# Altium project Graviton.PrjPcb (part 1 of 3)
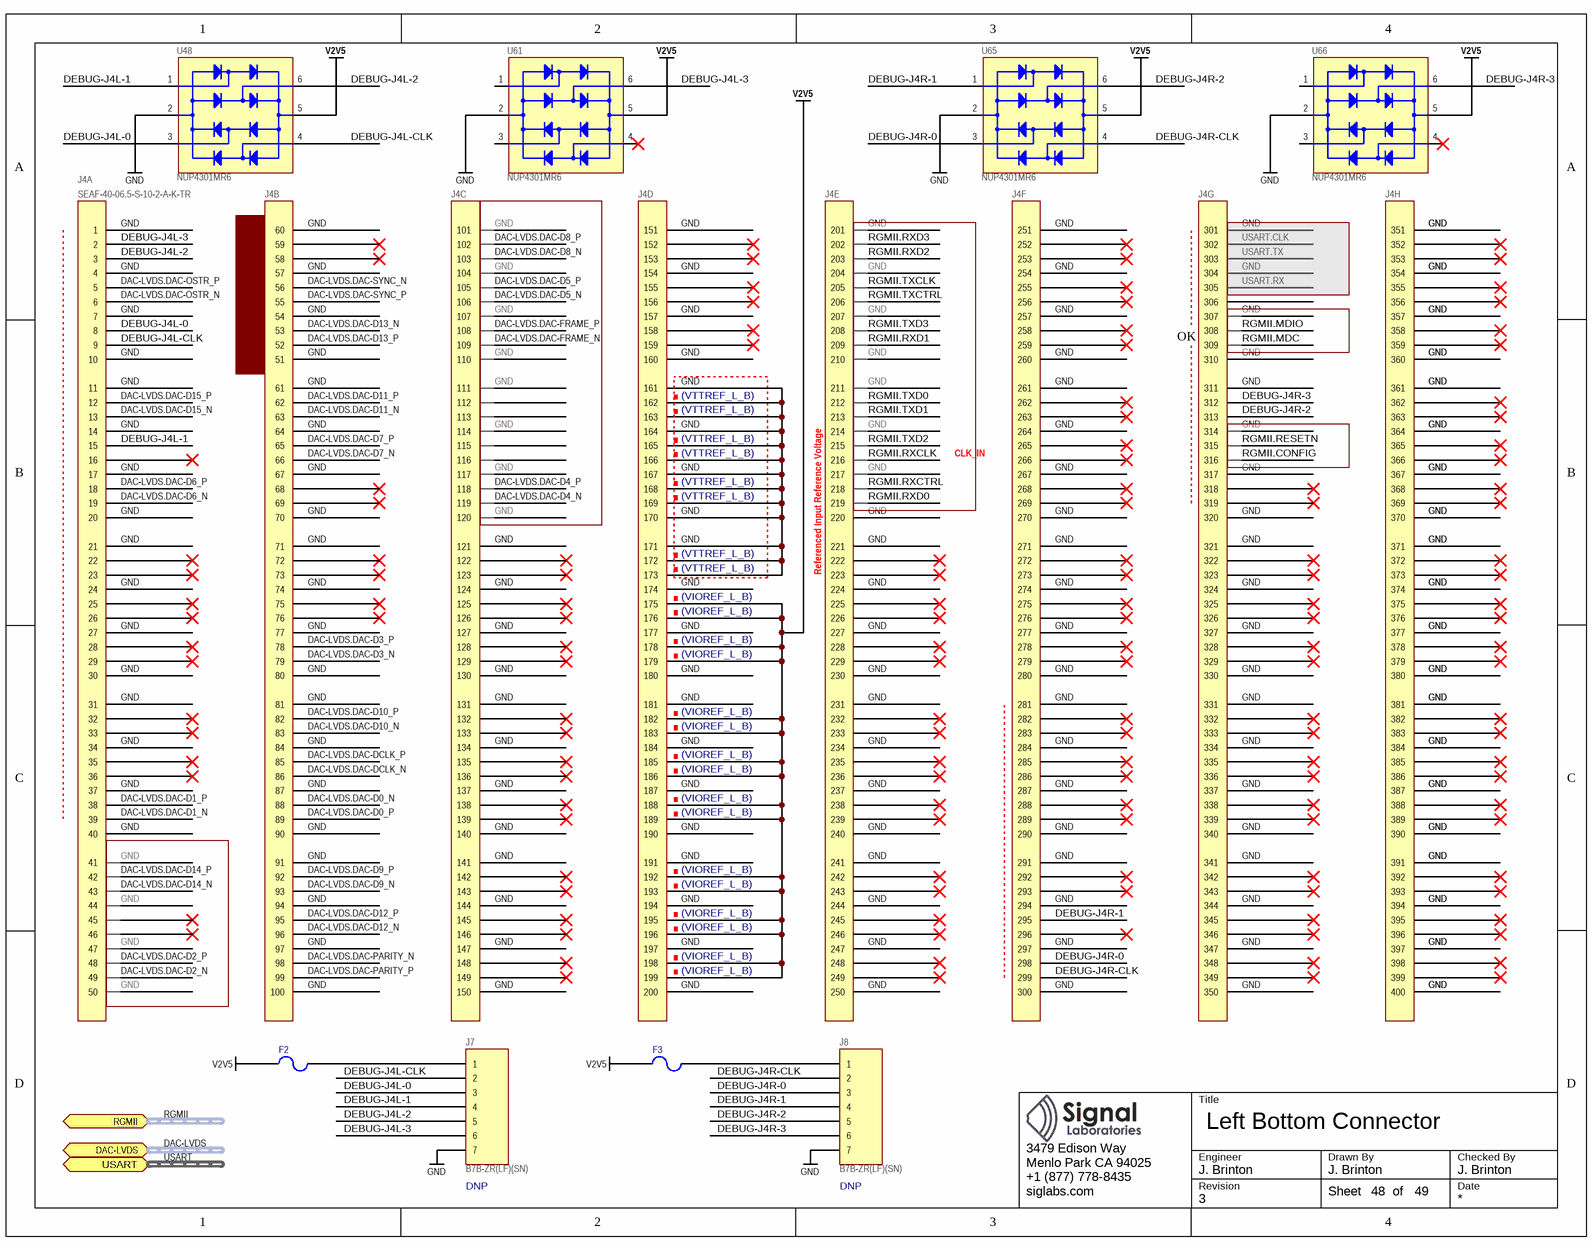
[diagram p0: con-left-bot.SchDoc]
23 sheets, 484 parts. Net scope: hierarchical (ports join the sheet entries above them; power ports are global).
Board file: graviton.PcbDoc
Sheets:
  con-left-bot.SchDoc
  con-right-bot.SchDoc
  eth.SchDoc
    ETH-LDO = eth-ldo.SchDoc
  dsa.SchDoc
  ifamp-tx.SchDoc
  amp-33dbm.SchDoc
  ifamp-rx.SchDoc
  dac.SchDoc
    DAC-DIGITAL = dac-digital.SchDoc
    DAC-ANALOG = dac-analog.SchDoc
    DAC-POWER = dac-power.SchDoc
    DAC-MISC = dac-misc.SchDoc
    DAC-LDO = dac-ldo.SchDoc
  adc.SchDoc
    ADC-DIGITAL = adc-digital.SchDoc
    ADC-POWER = adc-power.SchDoc
    ADC-ANALOG = adc-analog.SchDoc
    ADC-LDO = adc-ldo.SchDoc
  fans.SchDoc
  clock.SchDoc
  ingress.SchDoc
  adc-amp.SchDoc

## Sheet con-left-bot.SchDoc: Left Bottom Connector
size Letter; CheckedBy: J. Brinton; CompanyName: Signal Laboratories, Inc.; DrawnBy: J. Brinton; Engineer: J. Brinton; Address1: 3479 Edison Way; Address2: Menlo Park CA 94025; Address3: +1 (877) 778-8435; Address4: siglabs.com; Revision: 3; SheetNumber: 48; SheetTotal: 49; ModifiedDate: 4/20/2018

### Parts
F2  0ZCJ0020FF2E  [1206]  (value not drawn)
F3  0ZCJ0020FF2E  [1206]  (value not drawn)
J4  SEAF-40-06.5-S-10-2-A-K-TR  [SEAF-40-06.5-S-10-2-A-K-TR]  (parts A,B,C,D,E,F,G,H of 8)
J7  B7B-ZR(LF)(SN)  Do Not Place: DNP  [B7B-ZR]
J8  B7B-ZR(LF)(SN)  Do Not Place: DNP  [B7B-ZR]
U48  NUP4301MR6  [SOT23-6]
U61  NUP4301MR6  [SOT23-6]
U65  NUP4301MR6  [SOT23-6]
U66  NUP4301MR6  [SOT23-6]

### Ports
DAC-LVDS (harness DAC-LVDS), RGMII (harness RGMII), USART (harness USART-2V5)

### Nets
GND: J4.1 J4.4 J4.7 J4.10 J4.11 J4.14 J4.17 J4.20 J4.21 J4.24 J4.27 J4.30 J4.31 J4.34 J4.37 J4.40 J4.41 J4.44 J4.47 J4.50 J4.51 J4.54 J4.57 J4.60 J4.61 J4.64 J4.67 J4.70 J4.71 J4.74 J4.77 J4.80 J4.81 J4.84 J4.87 J4.90 J4.91 J4.94 J4.97 J4.100 J4.101 J4.104 J4.107 J4.110 J4.111 J4.114 J4.117 J4.120 J4.121 J4.124 J4.127 J4.130 J4.131 J4.134 J4.137 J4.140 J4.141 J4.144 J4.147 J4.150 J4.151 J4.154 J4.157 J4.160 J4.161 J4.162 J4.163 J4.164 J4.165 J4.166 J4.167 J4.168 J4.169 J4.170 J4.171 J4.172 J4.173 J4.174 J4.177 J4.180 J4.181 J4.184 J4.187 J4.190 J4.191 J4.194 J4.197 J4.200 J4.201 J4.204 J4.207 J4.210 J4.211 J4.214 J4.217 J4.220 J4.221 J4.224 J4.227 J4.230 J4.231 J4.234 J4.237 J4.240 J4.241 J4.244 J4.247 J4.250 J4.251 J4.254 J4.257 J4.260 J4.261 J4.264 J4.267 J4.270 J4.271 J4.274 J4.277 J4.280 J4.281 J4.284 J4.287 J4.290 J4.291 J4.294 J4.297 J4.300 J4.301 J4.304 J4.307 J4.310 J4.311 J4.314 J4.317 J4.320 J4.321 J4.324 J4.327 J4.330 J4.331 J4.334 J4.337 J4.340 J4.341 J4.344 J4.347 J4.350 J4.351 J4.354 J4.357 J4.360 J4.361 J4.364 J4.367 J4.370 J4.371 J4.374 J4.377 J4.380 J4.381 J4.384 J4.387 J4.390 J4.391 J4.394 J4.397 J4.400 J7.7 J8.7 U48.2(VN) U61.2(VN) U65.2(VN) U66.2(VN)
V2V5: F2.2 F3.2 J4.175 J4.176 J4.178 J4.179 J4.182 J4.183 J4.185 J4.186 J4.188 J4.189 J4.192 J4.193 J4.195 J4.196 J4.198 J4.199 U48.5(VP) U61.5(VP) U65.5(VP) U66.5(VP)
DAC-LVDS.DAC-D0_N: J4.88  [project net DAC-LVDS.DAC-D0_N_48]
DAC-LVDS.DAC-D0_P: J4.89  [project net DAC-LVDS.DAC-D0_P_48]
DAC-LVDS.DAC-D1_N: J4.39  [project net DAC-LVDS.DAC-D1_N_48]
DAC-LVDS.DAC-D1_P: J4.38  [project net DAC-LVDS.DAC-D1_P_48]
DAC-LVDS.DAC-D2_N: J4.49  [project net DAC-LVDS.DAC-D2_N_48]
DAC-LVDS.DAC-D2_P: J4.48  [project net DAC-LVDS.DAC-D2_P_48]
DAC-LVDS.DAC-D3_N: J4.79  [project net DAC-LVDS.DAC-D3_N_48]
DAC-LVDS.DAC-D3_P: J4.78  [project net DAC-LVDS.DAC-D3_P_48]
DAC-LVDS.DAC-D4_N: J4.119  [project net DAC-LVDS.DAC-D4_N_48]
DAC-LVDS.DAC-D4_P: J4.118  [project net DAC-LVDS.DAC-D4_P_48]
DAC-LVDS.DAC-D5_N: J4.106  [project net DAC-LVDS.DAC-D5_N_48]
DAC-LVDS.DAC-D5_P: J4.105  [project net DAC-LVDS.DAC-D5_P_48]
DAC-LVDS.DAC-D6_N: J4.19  [project net DAC-LVDS.DAC-D6_N_48]
DAC-LVDS.DAC-D6_P: J4.18  [project net DAC-LVDS.DAC-D6_P_48]
DAC-LVDS.DAC-D7_N: J4.66  [project net DAC-LVDS.DAC-D7_N_48]
DAC-LVDS.DAC-D7_P: J4.65  [project net DAC-LVDS.DAC-D7_P_48]
DAC-LVDS.DAC-D8_N: J4.103  [project net DAC-LVDS.DAC-D8_N_48]
DAC-LVDS.DAC-D8_P: J4.102  [project net DAC-LVDS.DAC-D8_P_48]
DAC-LVDS.DAC-D9_N: J4.93  [project net DAC-LVDS.DAC-D9_N_48]
DAC-LVDS.DAC-D9_P: J4.92  [project net DAC-LVDS.DAC-D9_P_48]
DAC-LVDS.DAC-D10_N: J4.83  [project net DAC-LVDS.DAC-D10_N_48]
DAC-LVDS.DAC-D10_P: J4.82  [project net DAC-LVDS.DAC-D10_P_48]
DAC-LVDS.DAC-D11_N: J4.63  [project net DAC-LVDS.DAC-D11_N_48]
DAC-LVDS.DAC-D11_P: J4.62  [project net DAC-LVDS.DAC-D11_P_48]
DAC-LVDS.DAC-D12_N: J4.96  [project net DAC-LVDS.DAC-D12_N_48]
DAC-LVDS.DAC-D12_P: J4.95  [project net DAC-LVDS.DAC-D12_P_48]
DAC-LVDS.DAC-D13_N: J4.53  [project net DAC-LVDS.DAC-D13_N_48]
DAC-LVDS.DAC-D13_P: J4.52  [project net DAC-LVDS.DAC-D13_P_48]
DAC-LVDS.DAC-D14_N: J4.43  [project net DAC-LVDS.DAC-D14_N_48]
DAC-LVDS.DAC-D14_P: J4.42  [project net DAC-LVDS.DAC-D14_P_48]
DAC-LVDS.DAC-D15_N: J4.13  [project net DAC-LVDS.DAC-D15_N_48]
DAC-LVDS.DAC-D15_P: J4.12  [project net DAC-LVDS.DAC-D15_P_48]
DAC-LVDS.DAC-DCLK_N: J4.86  [project net DAC-LVDS.DAC-DCLK_N_48]
DAC-LVDS.DAC-DCLK_P: J4.85  [project net DAC-LVDS.DAC-DCLK_P_48]
DAC-LVDS.DAC-FRAME_N: J4.109  [project net DAC-LVDS.DAC-FRAME_N_48]
DAC-LVDS.DAC-FRAME_P: J4.108  [project net DAC-LVDS.DAC-FRAME_P_48]
DAC-LVDS.DAC-OSTR_N: J4.6  [project net DAC-LVDS.DAC-OSTR_N_48]
DAC-LVDS.DAC-OSTR_P: J4.5  [project net DAC-LVDS.DAC-OSTR_P_48]
DAC-LVDS.DAC-PARITY_N: J4.98  [project net DAC-LVDS.DAC-PARITY_N_48]
DAC-LVDS.DAC-PARITY_P: J4.99  [project net DAC-LVDS.DAC-PARITY_P_48]
DAC-LVDS.DAC-SYNC_N: J4.56  [project net DAC-LVDS.DAC-SYNC_N_48]
DAC-LVDS.DAC-SYNC_P: J4.55  [project net DAC-LVDS.DAC-SYNC_P_48]
DEBUG-J4L-0: J4.8 J7.3 U48.3(B)  [project net DEBUG-J4L-0_48]
DEBUG-J4L-1: J4.15 J7.4 U48.1(A)  [project net DEBUG-J4L-1_48]
DEBUG-J4L-2: J4.3 J7.5 U48.6(D)  [project net DEBUG-J4L-2_48]
DEBUG-J4L-3: J4.2 J7.6 U61.6(D)  [project net DEBUG-J4L-3_48]
DEBUG-J4L-CLK: J4.9 J7.2 U48.4(C)  [project net DEBUG-J4L-CLK_48]
DEBUG-J4R-0: J4.298 J8.3 U65.3(B)  [project net DEBUG-J4R-0_48]
DEBUG-J4R-1: J4.295 J8.4 U65.1(A)  [project net DEBUG-J4R-1_48]
DEBUG-J4R-2: J4.313 J8.5 U65.6(D)  [project net DEBUG-J4R-2_48]
DEBUG-J4R-3: J4.312 J8.6 U66.6(D)  [project net DEBUG-J4R-3_48]
DEBUG-J4R-CLK: J4.299 J8.2 U65.4(C)  [project net DEBUG-J4R-CLK_48]
RGMII.CONFIG: J4.316  [project net RGMII.CONFIG_48]
RGMII.MDC: J4.309  [project net RGMII.MDC_48]
RGMII.MDIO: J4.308  [project net RGMII.MDIO_48]
RGMII.RESETN: J4.315  [project net RGMII.RESETN_48]
RGMII.RXCLK: J4.216  [project net RGMII.RXCLK_48]
RGMII.RXCTRL: J4.218  [project net RGMII.RXCTRL_48]
RGMII.RXD0: J4.219  [project net RGMII.RXD0_48]
RGMII.RXD1: J4.209  [project net RGMII.RXD1_48]
RGMII.RXD2: J4.203  [project net RGMII.RXD2_48]
RGMII.RXD3: J4.202  [project net RGMII.RXD3_48]
RGMII.TXCLK: J4.205  [project net RGMII.TXCLK_48]
RGMII.TXCTRL: J4.206  [project net RGMII.TXCTRL_48]
RGMII.TXD0: J4.212  [project net RGMII.TXD0_48]
RGMII.TXD1: J4.213  [project net RGMII.TXD1_48]
RGMII.TXD2: J4.215  [project net RGMII.TXD2_48]
RGMII.TXD3: J4.208  [project net RGMII.TXD3_48]
USART.CLK: J4.302  [project net USART.CLK_48]
USART.RX: J4.305  [project net USART.RX_48]
USART.TX: J4.303  [project net USART.TX_48]
NetF2_1: F2.1 J7.1
NetF3_1: F3.1 J8.1

Not connected (* = marked no-connect by the designer): J4 16* 22* 23* 25* 26* 28* 29* 32* 33* 35* 36* 45* 46* 58* 59* 68* 69* 72* 73* 75* 76* 112 113 115 116 122* 123* 125* 126* 128* 129* 132* 133* 135* 136* 138* 139* 142* 143* 145* 146* 148* 149* 152* 153* 155* 156* 158* 159* 222* 223* 225* 226* 228* 229* 232* 233* 235* 236* 238* 239* 242* 243* 245* 246* 248* 249* 252* 253* 255* 256* 258* 259* 262* 263* 265* 266* 268* 269* 272* 273* 275* 276* 278* 279* 282* 283* 285* 286* 288* 289* 292* 293* 296* 306 318* 319* 322* 323* 325* 326* 328* 329* 332* 333* 335* 336* 338* 339* 342* 343* 345* 346* 348* 349* 352* 353* 355* 356* 358* 359* 362* 363* 365* 366* 368* 369* 372* 373* 375* 376* 378* 379* 382* 383* 385* 386* 388* 389* 392* 393* 395* 396* 398* 399*; U61 1(A) 3(B) 4(C)*; U66 1(A) 3(B) 4(C)*

### Buses and harness runs
harness DAC-LVDS = port DAC-LVDS
harness RGMII = port RGMII
harness USART = port USART

### Notes on the sheet
- (near J4) (VTTREF_L_B)
- (near J4) OK
- (near J4) CLK_IN
- (near J4) (VIOREF_L_B)
- (near J4) Referenced Input Reference Voltage
- Title
- Engineer
- Revision
- Drawn By
- Checked By
- Date
- Sheet
- of

### Library data of the parts
F2 F3 = 0ZCJ0020FF2E: PTC Resettable Fuse, 0.2A, 30V, SMD 1206; Manufacturer: Bell Fuse; Manufacturer P/N: 0ZCJ0020FF2E; Package: 1206
J4 = SEAF-40-06.5-S-10-2-A-K-TR: Terminal Array Assembly, Surface Mount, 0.050" Pitch, 400 Pins; Manufacturer: Samtec; Manufacturer P/N: SEAF-40-06.5-S-10-2-A-K-TR
J7 J8 = B7B-ZR(LF)(SN): Through-hole Shrouded Header 7-Position; Manufacturer: JST; Manufacturer P/N: B7B-ZR(LF)(SN)
U48 U61 U65 U66 = NUP4301MR6: 4-Lane TVS Diode Array; Manufacturer: On Semiconductor; Manufacturer P/N: NUP4301MR6

## Sheet con-right-bot.SchDoc: Right Bottom Connector
size Letter; CheckedBy: J. Brinton; CompanyName: Signal Laboratories, Inc.; DrawnBy: J. Brinton; Engineer: J. Brinton; Address1: 3479 Edison Way; Address2: Menlo Park CA 94025; Address3: +1 (877) 778-8435; Address4: siglabs.com; Revision: 3; SheetNumber: 47; SheetTotal: 49; ModifiedDate: 4/20/2018
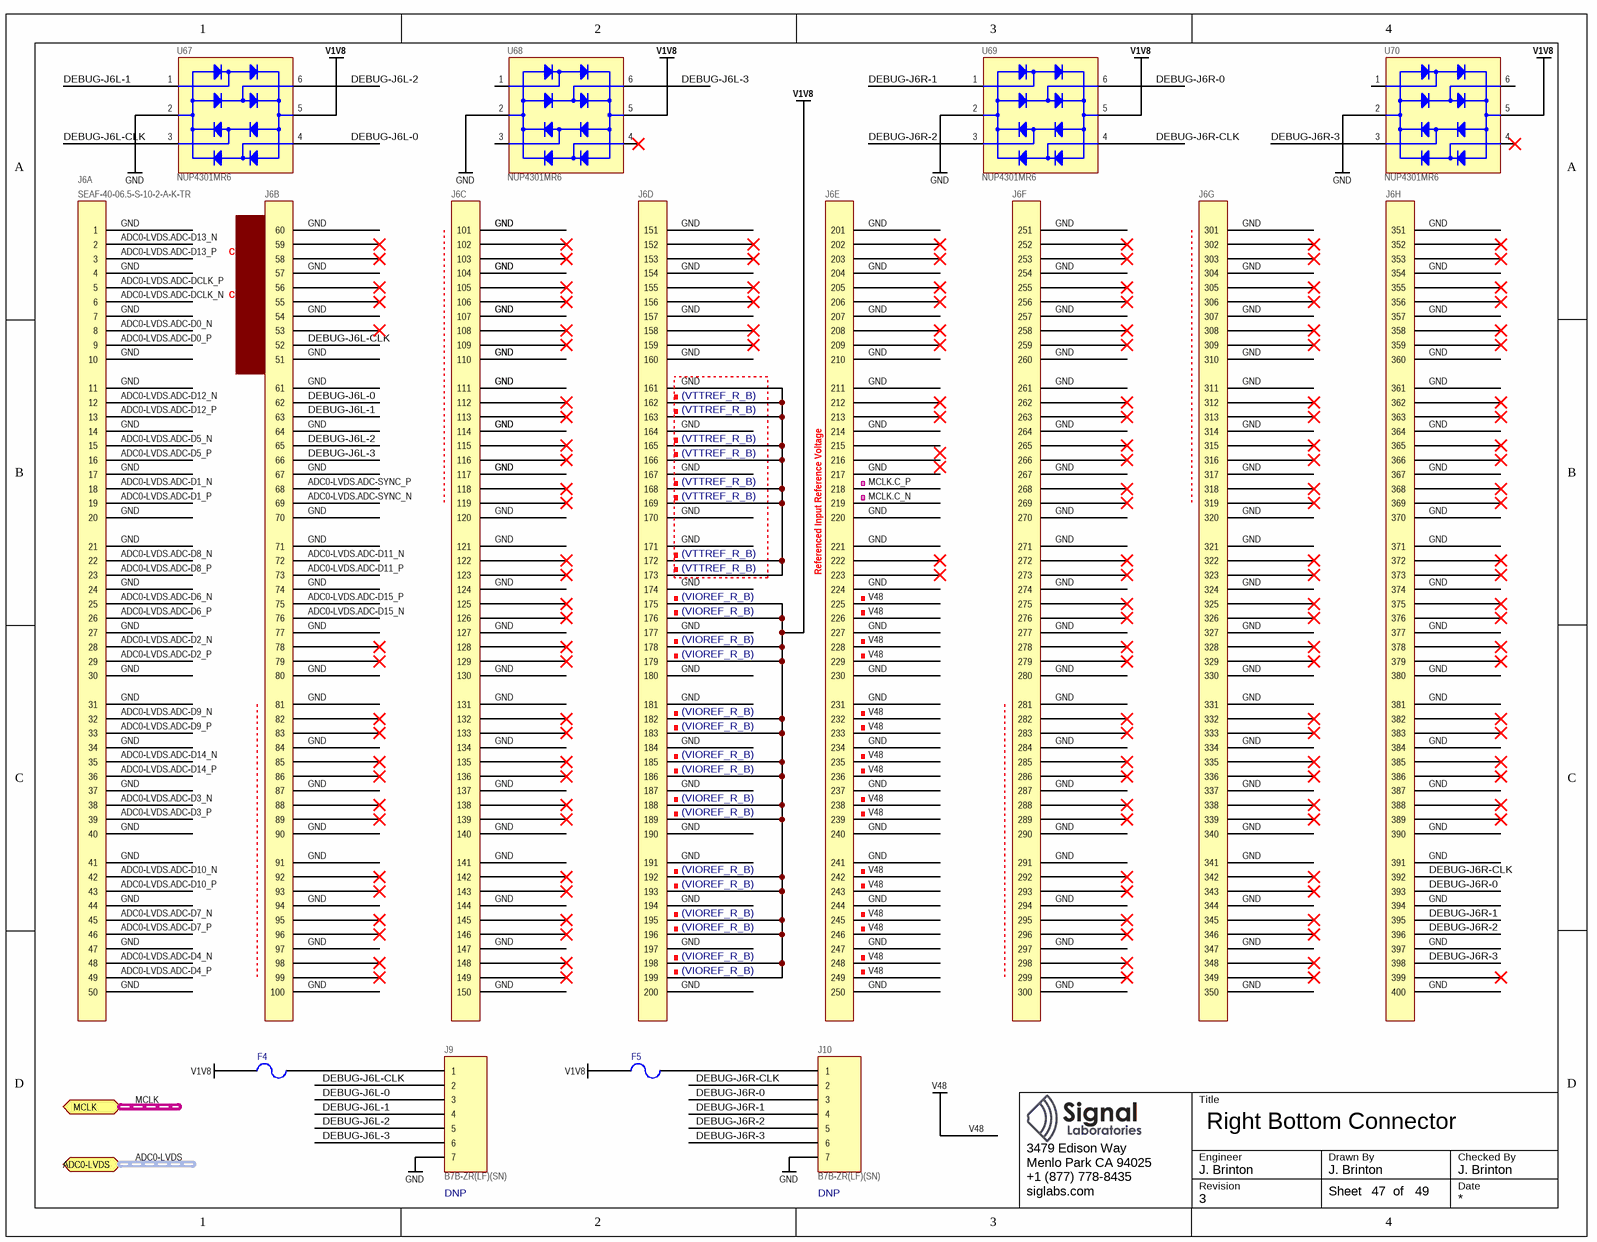
[diagram p1: con-right-bot.SchDoc]

### Parts
F4  0ZCJ0020FF2E  [1206]  (value not drawn)
F5  0ZCJ0020FF2E  [1206]  (value not drawn)
J6  SEAF-40-06.5-S-10-2-A-K-TR  [SEAF-40-06.5-S-10-2-A-K-TR]  (parts A,B,C,D,E,F,G,H of 8)
J9  B7B-ZR(LF)(SN)  Do Not Place: DNP  [B7B-ZR]
J10  B7B-ZR(LF)(SN)  Do Not Place: DNP  [B7B-ZR]
U67  NUP4301MR6  [SOT23-6]
U68  NUP4301MR6  [SOT23-6]
U69  NUP4301MR6  [SOT23-6]
U70  NUP4301MR6  [SOT23-6]

### Ports
ADC0-LVDS (harness ADC-LVDS), MCLK (harness CLK-LVPECL33)

### Nets
GND: J6.1 J6.4 J6.7 J6.10 J6.11 J6.14 J6.17 J6.20 J6.21 J6.24 J6.27 J6.30 J6.31 J6.34 J6.37 J6.40 J6.41 J6.44 J6.47 J6.50 J6.51 J6.54 J6.57 J6.60 J6.61 J6.64 J6.67 J6.70 J6.71 J6.74 J6.77 J6.80 J6.81 J6.84 J6.87 J6.90 J6.91 J6.94 J6.97 J6.100 J6.101 J6.104 J6.107 J6.110 J6.111 J6.114 J6.117 J6.120 J6.121 J6.124 J6.127 J6.130 J6.131 J6.134 J6.137 J6.140 J6.141 J6.144 J6.147 J6.150 J6.151 J6.154 J6.157 J6.160 J6.161 J6.162 J6.163 J6.164 J6.165 J6.166 J6.167 J6.168 J6.169 J6.170 J6.171 J6.172 J6.173 J6.174 J6.177 J6.180 J6.181 J6.184 J6.187 J6.190 J6.191 J6.194 J6.197 J6.200 J6.201 J6.204 J6.207 J6.210 J6.211 J6.214 J6.217 J6.220 J6.221 J6.224 J6.227 J6.230 J6.231 J6.234 J6.237 J6.240 J6.241 J6.244 J6.247 J6.250 J6.251 J6.254 J6.257 J6.260 J6.261 J6.264 J6.267 J6.270 J6.271 J6.274 J6.277 J6.280 J6.281 J6.284 J6.287 J6.290 J6.291 J6.294 J6.297 J6.300 J6.301 J6.304 J6.307 J6.310 J6.311 J6.314 J6.317 J6.320 J6.321 J6.324 J6.327 J6.330 J6.331 J6.334 J6.337 J6.340 J6.341 J6.344 J6.347 J6.350 J6.351 J6.354 J6.357 J6.360 J6.361 J6.364 J6.367 J6.370 J6.371 J6.374 J6.377 J6.380 J6.381 J6.384 J6.387 J6.390 J6.391 J6.394 J6.397 J6.400 J9.7 J10.7 U67.2(VN) U68.2(VN) U69.2(VN) U70.2(VN)
V1V8: F4.2 F5.2 J6.175 J6.176 J6.178 J6.179 J6.182 J6.183 J6.185 J6.186 J6.188 J6.189 J6.192 J6.193 J6.195 J6.196 J6.198 J6.199 U67.5(VP) U68.5(VP) U69.5(VP) U70.5(VP)
V48: J6.225 J6.226 J6.228 J6.229 J6.232 J6.233 J6.235 J6.236 J6.238 J6.239 J6.242 J6.243 J6.245 J6.246 J6.248 J6.249
ADC0-LVDS.ADC-D0_N: J6.8  [project net ADC0-LVDS.ADC-D0_N_47]
ADC0-LVDS.ADC-D0_P: J6.9  [project net ADC0-LVDS.ADC-D0_P_47]
ADC0-LVDS.ADC-D1_N: J6.18  [project net ADC0-LVDS.ADC-D1_N_47]
ADC0-LVDS.ADC-D1_P: J6.19  [project net ADC0-LVDS.ADC-D1_P_47]
ADC0-LVDS.ADC-D2_N: J6.28  [project net ADC0-LVDS.ADC-D2_N_47]
ADC0-LVDS.ADC-D2_P: J6.29  [project net ADC0-LVDS.ADC-D2_P_47]
ADC0-LVDS.ADC-D3_N: J6.38  [project net ADC0-LVDS.ADC-D3_N_47]
ADC0-LVDS.ADC-D3_P: J6.39  [project net ADC0-LVDS.ADC-D3_P_47]
ADC0-LVDS.ADC-D4_N: J6.48  [project net ADC0-LVDS.ADC-D4_N_47]
ADC0-LVDS.ADC-D4_P: J6.49  [project net ADC0-LVDS.ADC-D4_P_47]
ADC0-LVDS.ADC-D5_N: J6.15  [project net ADC0-LVDS.ADC-D5_N_47]
ADC0-LVDS.ADC-D5_P: J6.16  [project net ADC0-LVDS.ADC-D5_P_47]
ADC0-LVDS.ADC-D6_N: J6.25  [project net ADC0-LVDS.ADC-D6_N_47]
ADC0-LVDS.ADC-D6_P: J6.26  [project net ADC0-LVDS.ADC-D6_P_47]
ADC0-LVDS.ADC-D7_N: J6.45  [project net ADC0-LVDS.ADC-D7_N_47]
ADC0-LVDS.ADC-D7_P: J6.46  [project net ADC0-LVDS.ADC-D7_P_47]
ADC0-LVDS.ADC-D8_N: J6.22  [project net ADC0-LVDS.ADC-D8_N_47]
ADC0-LVDS.ADC-D8_P: J6.23  [project net ADC0-LVDS.ADC-D8_P_47]
ADC0-LVDS.ADC-D9_N: J6.32  [project net ADC0-LVDS.ADC-D9_N_47]
ADC0-LVDS.ADC-D9_P: J6.33  [project net ADC0-LVDS.ADC-D9_P_47]
ADC0-LVDS.ADC-D10_N: J6.42  [project net ADC0-LVDS.ADC-D10_N_47]
ADC0-LVDS.ADC-D10_P: J6.43  [project net ADC0-LVDS.ADC-D10_P_47]
ADC0-LVDS.ADC-D11_N: J6.72  [project net ADC0-LVDS.ADC-D11_N_47]
ADC0-LVDS.ADC-D11_P: J6.73  [project net ADC0-LVDS.ADC-D11_P_47]
ADC0-LVDS.ADC-D12_N: J6.12  [project net ADC0-LVDS.ADC-D12_N_47]
ADC0-LVDS.ADC-D12_P: J6.13  [project net ADC0-LVDS.ADC-D12_P_47]
ADC0-LVDS.ADC-D13_N: J6.2  [project net ADC0-LVDS.ADC-D13_N_47]
ADC0-LVDS.ADC-D13_P: J6.3  [project net ADC0-LVDS.ADC-D13_P_47]
ADC0-LVDS.ADC-D14_N: J6.35  [project net ADC0-LVDS.ADC-D14_N_47]
ADC0-LVDS.ADC-D14_P: J6.36  [project net ADC0-LVDS.ADC-D14_P_47]
ADC0-LVDS.ADC-D15_N: J6.76  [project net ADC0-LVDS.ADC-D15_N_47]
ADC0-LVDS.ADC-D15_P: J6.75  [project net ADC0-LVDS.ADC-D15_P_47]
ADC0-LVDS.ADC-DCLK_N: J6.6  [project net ADC0-LVDS.ADC-DCLK_N_47]
ADC0-LVDS.ADC-DCLK_P: J6.5  [project net ADC0-LVDS.ADC-DCLK_P_47]
ADC0-LVDS.ADC-SYNC_N: J6.69  [project net ADC0-LVDS.ADC-SYNC_N_47]
ADC0-LVDS.ADC-SYNC_P: J6.68  [project net ADC0-LVDS.ADC-SYNC_P_47]
DEBUG-J6L-0: J6.62 J9.3 U67.4(C)  [project net DEBUG-J6L-0_47]
DEBUG-J6L-1: J6.63 J9.4 U67.1(A)  [project net DEBUG-J6L-1_47]
DEBUG-J6L-2: J6.65 J9.5 U67.6(D)  [project net DEBUG-J6L-2_47]
DEBUG-J6L-3: J6.66 J9.6 U68.6(D)  [project net DEBUG-J6L-3_47]
DEBUG-J6L-CLK: J6.52 J9.2 U67.3(B)  [project net DEBUG-J6L-CLK_47]
DEBUG-J6R-0: J6.393 J10.3 U69.6(D)  [project net DEBUG-J6R-0_47]
DEBUG-J6R-1: J6.395 J10.4 U69.1(A)  [project net DEBUG-J6R-1_47]
DEBUG-J6R-2: J6.396 J10.5 U69.3(B)  [project net DEBUG-J6R-2_47]
DEBUG-J6R-3: J6.398 J10.6 U70.3(B)  [project net DEBUG-J6R-3_47]
DEBUG-J6R-CLK: J6.392 J10.2 U69.4(C)  [project net DEBUG-J6R-CLK_47]
MCLK.C_N: J6.219  [project net MCLK.C_N_47]
MCLK.C_P: J6.218  [project net MCLK.C_P_47]
NetF4_1: F4.1 J9.1
NetF5_1: F5.1 J10.1

Not connected (* = marked no-connect by the designer): J6 53* 55* 56* 58* 59* 78* 79* 82* 83* 85* 86* 88* 89* 92* 93* 95* 96* 98* 99* 102* 103* 105* 106* 108* 109* 112* 113* 115* 116* 118* 119* 122* 123* 125* 126* 128* 129* 132* 133* 135* 136* 138* 139* 142* 143* 145* 146* 148* 149* 152* 153* 155* 156* 158* 159* 202* 203* 205* 206* 208* 209* 212* 213* 215 216 222* 223* 252* 253* 255* 256* 258* 259* 262* 263* 265* 266* 268* 269* 272* 273* 275* 276* 278* 279* 282* 283* 285* 286* 288* 289* 292* 293* 295* 296* 298* 299* 302* 303* 305* 306* 308* 309* 312* 313* 315* 316* 318* 319* 322* 323* 325* 326* 328* 329* 332* 333* 335* 336* 338* 339* 342* 343* 345* 346* 348* 349* 352* 353* 355* 356* 358* 359* 362* 363* 365* 366* 368* 369* 372* 373* 375* 376* 378* 379* 382* 383* 385* 386* 388* 389* 399*; U68 1(A) 3(B) 4(C)*; U70 1(A) 4(C)* 6(D)

### Buses and harness runs
harness ADC0-LVDS = port ADC0-LVDS
harness MCLK = port MCLK

### Notes on the sheet
- (near J6) CLK_IN
- (near J6) (VTTREF_R_B)
- (near J6) (VIOREF_R_B)
- (near J6) Referenced Input Reference Voltage
- Title
- Engineer
- Revision
- Drawn By
- Checked By
- Date
- Sheet
- of

### Library data of the parts
F4 F5 = 0ZCJ0020FF2E: as F2 on sheet con-left-bot; Manufacturer P/N: 0ZCJ0020FF2E; Package: 1206
J6 = SEAF-40-06.5-S-10-2-A-K-TR: as J4 on sheet con-left-bot; Manufacturer P/N: SEAF-40-06.5-S-10-2-A-K-TR
J9 J10 = B7B-ZR(LF)(SN): as J7 on sheet con-left-bot; Manufacturer P/N: B7B-ZR(LF)(SN)
U67-U70 = NUP4301MR6: as U48 on sheet con-left-bot; Manufacturer P/N: NUP4301MR6

## Sheet eth.SchDoc: Ethernet
size Letter; CheckedBy: J. Brinton; CompanyName: Signal Laboratories, Inc.; DrawnBy: J. Brinton; Engineer: J. Brinton; Address1: 3479 Edison Way; Address2: Menlo Park CA 94025; Address3: +1 (877) 778-8435; Address4: siglabs.com; Revision: 3; SheetNumber: 30; SheetTotal: 49
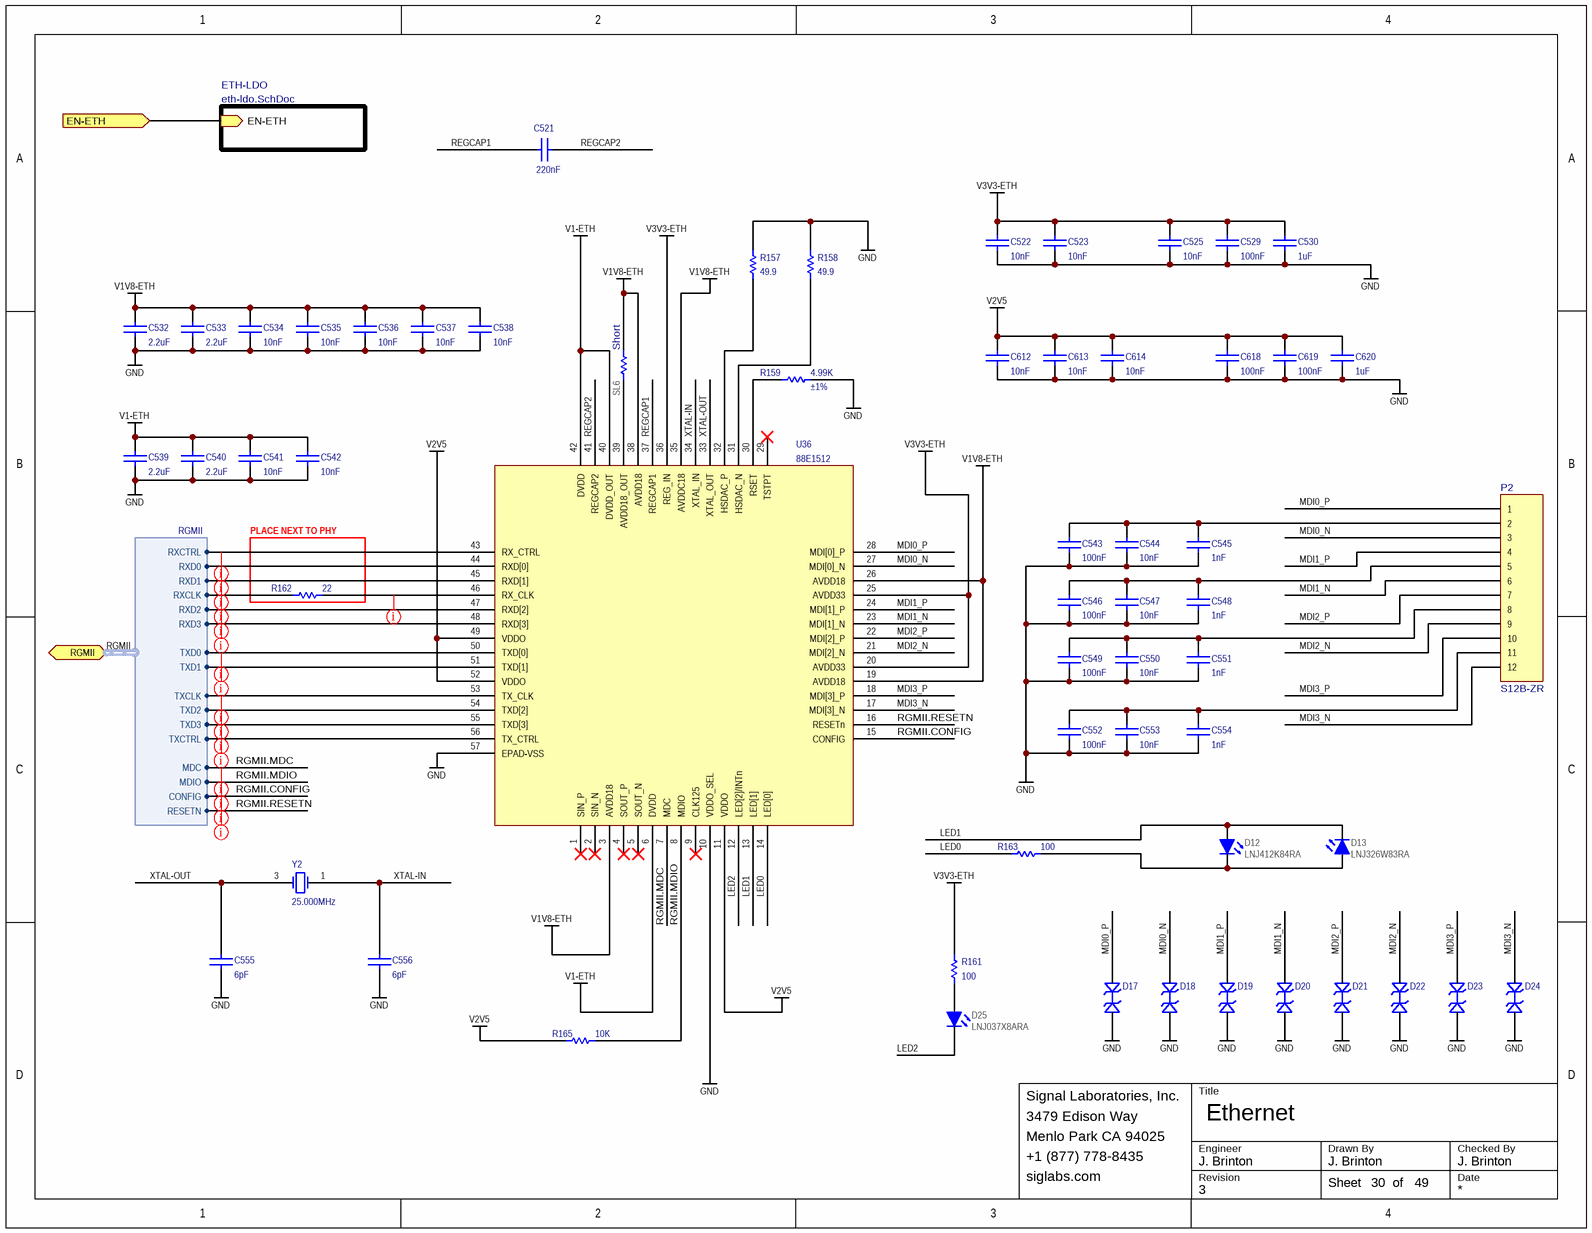
[diagram p2: eth.SchDoc]

### Parts
C521  value 220nF  [CAPC100X50X55L25N]  (hidden comment: C1005X7R1E224K050BE)
C522  value 10nF  [CAPC100X50X55L25N]  (hidden comment: GRM155R71H103KA88)
C523  value 10nF  [CAPC100X50X55L25N]  (hidden comment: GRM155R71H103KA88)
C525  value 10nF  [CAPC100X50X55L25N]  (hidden comment: GRM155R71H103KA88)
C529  value 100nF  [CAPC100X50X55L25N]  (hidden comment: GRM155R71C104KA88J)
C530  value 1uF  [CAPC100X50X55L25N]  (hidden comment: GRM155R61A105KE15)
C532  value 2.2uF  [CAPC160X80X90L20N]  (hidden comment: GRM188R71A225KE15D)
C533  value 2.2uF  [CAPC160X80X90L20N]  (hidden comment: GRM188R71A225KE15D)
C534  value 10nF  [CAPC100X50X55L25N]  (hidden comment: GRM155R71H103KA88)
C535  value 10nF  [CAPC100X50X55L25N]  (hidden comment: GRM155R71H103KA88)
C536  value 10nF  [CAPC100X50X55L25N]  (hidden comment: GRM155R71H103KA88)
C537  value 10nF  [CAPC100X50X55L25N]  (hidden comment: GRM155R71H103KA88)
C538  value 10nF  [CAPC100X50X55L25N]  (hidden comment: GRM155R71H103KA88)
C539  value 2.2uF  [CAPC160X80X90L20N]  (hidden comment: GRM188R71A225KE15D)
C540  value 2.2uF  [CAPC160X80X90L20N]  (hidden comment: GRM188R71A225KE15D)
C541  value 10nF  [CAPC100X50X55L25N]  (hidden comment: GRM155R71H103KA88)
C542  value 10nF  [CAPC100X50X55L25N]  (hidden comment: GRM155R71H103KA88)
C543  value 100nF  [CAPC100X50X55L25N]  (hidden comment: GRM155R71C104KA88J)
C544  value 10nF  [CAPC100X50X55L25N]  (hidden comment: GRM155R71H103KA88)
C545  value 1nF  [CAPC100X50X55L25N]  (hidden comment: CGA2B2NP01H102J050BA)
C546  value 100nF  [CAPC100X50X55L25N]  (hidden comment: GRM155R71C104KA88J)
C547  value 10nF  [CAPC100X50X55L25N]  (hidden comment: GRM155R71H103KA88)
C548  value 1nF  [CAPC100X50X55L25N]  (hidden comment: CGA2B2NP01H102J050BA)
C549  value 100nF  [CAPC100X50X55L25N]  (hidden comment: GRM155R71C104KA88J)
C550  value 10nF  [CAPC100X50X55L25N]  (hidden comment: GRM155R71H103KA88)
C551  value 1nF  [CAPC100X50X55L25N]  (hidden comment: CGA2B2NP01H102J050BA)
C552  value 100nF  [CAPC100X50X55L25N]  (hidden comment: GRM155R71C104KA88J)
C553  value 10nF  [CAPC100X50X55L25N]  (hidden comment: GRM155R71H103KA88)
C554  value 1nF  [CAPC100X50X55L25N]  (hidden comment: CGA2B2NP01H102J050BA)
C555  value 6pF  [CAPC100X50X55L25N]  (hidden comment: GJM1555C1H6R0CB01D)
C556  value 6pF  [CAPC100X50X55L25N]  (hidden comment: GJM1555C1H6R0CB01D)
C612  value 10nF  [CAPC100X50X55L25N]  (hidden comment: GRM155R71H103KA88)
C613  value 10nF  [CAPC100X50X55L25N]  (hidden comment: GRM155R71H103KA88)
C614  value 10nF  [CAPC100X50X55L25N]  (hidden comment: GRM155R71H103KA88)
C618  value 100nF  [CAPC100X50X55L25N]  (hidden comment: GRM155R71C104KA88J)
C619  value 100nF  [CAPC100X50X55L25N]  (hidden comment: GRM155R71C104KA88J)
C620  value 1uF  [CAPC100X50X55L25N]  (hidden comment: GRM155R61A105KE15)
D12  LNJ412K84RA  [0603_LED]
D13  LNJ326W83RA  [0603_LED]
D17  ESD8472  [XFDFN-2]  (value not drawn)
D18  ESD8472  [XFDFN-2]  (value not drawn)
D19  ESD8472  [XFDFN-2]  (value not drawn)
D20  ESD8472  [XFDFN-2]  (value not drawn)
D21  ESD8472  [XFDFN-2]  (value not drawn)
D22  ESD8472  [XFDFN-2]  (value not drawn)
D23  ESD8472  [XFDFN-2]  (value not drawn)
D24  ESD8472  [XFDFN-2]  (value not drawn)
D25  LNJ037X8ARA  [0603_LED]
P2  S12B-ZR  [S12B-ZR]
R157  value 49.9  [RESC1005X40N]  (hidden comment: ERA-2AEB49R9X)
R158  value 49.9  [RESC1005X40N]  (hidden comment: ERA-2AEB49R9X)
R159  value 4.99K  Tolerance: ±1%  [RESC1005X40N]  (hidden comment: ERJ-2RKF4991X)
R161  value 100  [RESC1005X40N]  (hidden comment: ERA-2AEB101X)
R162  value 22  [RESC1005X40N]  (hidden comment: RC0402FR-0722RL)
R163  value 100  [RESC1005X40N]  (hidden comment: ERA-2AEB101X)
R165  value 10K  [RESC1005X40N]  (hidden comment: ERJ-2RKF1002X)
SL6  Notes: Short  [SOLDERLINK0603X26N_BRIDGED]  (hidden comment: SOLDER_LINK)  (no BOM)
U36  88E1512  [QFN-56]
Y2  Freq: 25.000MHz  [XRCGB]  (hidden comment: XRCGB25M000F3N00R0)

### Blocks framed on the sheet
PLACE NEXT TO PHY: R162

### Sub-sheets
ETH-LDO = eth-ldo.SchDoc: EN-ETH (in)

### Ports
EN-ETH (in), RGMII (harness RGMII)

### Harnesses
RGMII: RXCTRL, RXD0, RXD1, RXD2, RXD3, RXCLK, TXCTRL, TXD0, TXD1, TXD2, TXD3, TXCLK, MDC, MDIO, RESETN, CONFIG

### Nets
GND: C522.1 C523.1 C525.1 C529.1 C530.1 C532.1 C533.1 C534.1 C535.1 C536.1 C537.1 C538.1 C539.1 C540.1 C541.1 C542.1 C543.1 C544.1 C545.1 C546.1 C547.1 C548.1 C549.1 C550.1 C551.1 C552.1 C553.1 C554.1 C555.1 C556.1 C612.1 C613.1 C614.1 C618.1 C619.1 C620.1 D17.2 D18.2 D19.2 D20.2 D21.2 D22.2 D23.2 D24.2 R157.1 R158.1 R159.1 U36.10(VDDO_SEL) U36.57(EPAD-VSS)
V1-ETH: C539.2 C540.2 C541.2 C542.2 U36.6(DVDD) U36.40(DVDD_OUT) U36.42(DVDD)
V1V8-ETH: C532.2 C533.2 C534.2 C535.2 C536.2 C537.2 C538.2 SL6.1 U36.3(AVDD18) U36.19(AVDD18) U36.26(AVDD18) U36.35(AVDDC18) U36.38(AVDD18)
V2V5: C612.2 C613.2 C614.2 C618.2 C619.2 C620.2 R165.2 U36.11(VDDO) U36.49(VDDO) U36.52(VDDO)
V3V3-ETH: C522.2 C523.2 C525.2 C529.2 C530.2 R161.1 U36.20(AVDD33) U36.25(AVDD33) U36.36(REG_IN)
LED0: R163.1 U36.14(LED[0])  [project net LED0_30]
LED1: D12.1(A) D13.2(K) U36.13(LED[1])  [project net LED1_30]
LED2: D25.2(K) U36.12(LED[2]/INTn)  [project net LED2_30]
MDI0_N: D18.1 P2.3 U36.27(MDI[0]_N)  [project net MDI0_N_30]
MDI0_P: D17.1 P2.1 U36.28(MDI[0]_P)  [project net MDI0_P_30]
MDI1_N: D20.1 P2.6 U36.23(MDI[1]_N)  [project net MDI1_N_30]
MDI1_P: D19.1 P2.4 U36.24(MDI[1]_P)  [project net MDI1_P_30]
MDI2_N: D22.1 P2.9 U36.21(MDI[2]_N)  [project net MDI2_N_30]
MDI2_P: D21.1 P2.7 U36.22(MDI[2]_P)  [project net MDI2_P_30]
MDI3_N: D24.1 P2.12 U36.17(MDI[3]_N)  [project net MDI3_N_30]
MDI3_P: D23.1 P2.10 U36.18(MDI[3]_P)  [project net MDI3_P_30]
REGCAP1: C521.1 U36.37(REGCAP1)  [project net REGCAP1_30]
REGCAP2: C521.2 U36.41(REGCAP2)  [project net REGCAP2_30]
RGMII.CONFIG: U36.15(CONFIG) ; port RGMII.CONFIG
RGMII.MDC: U36.7(MDC) ; port RGMII.MDC
RGMII.MDIO: R165.1 U36.8(MDIO) ; port RGMII.MDIO
RGMII.RESETN: U36.16(RESETn) ; port RGMII.RESETN
RGMII.RXCLK: R162.1 ; port RGMII.RXCLK
RGMII.RXCTRL: U36.43(RX_CTRL) ; port RGMII.RXCTRL
RGMII.RXD0: U36.44(RXD[0]) ; port RGMII.RXD0
RGMII.RXD1: U36.45(RXD[1]) ; port RGMII.RXD1
RGMII.RXD2: U36.47(RXD[2]) ; port RGMII.RXD2
RGMII.RXD3: U36.48(RXD[3]) ; port RGMII.RXD3
RGMII.TXCLK: U36.53(TX_CLK) ; port RGMII.TXCLK
RGMII.TXCTRL: U36.56(TX_CTRL) ; port RGMII.TXCTRL
RGMII.TXD0: U36.50(TXD[0]) ; port RGMII.TXD0
RGMII.TXD1: U36.51(TXD[1]) ; port RGMII.TXD1
RGMII.TXD2: U36.54(TXD[2]) ; port RGMII.TXD2
RGMII.TXD3: U36.55(TXD[3]) ; port RGMII.TXD3
XTAL-IN: C556.2 U36.34(XTAL_IN) Y2.1(OSC1)  [project net XTAL-IN_30]
XTAL-OUT: C555.2 U36.33(XTAL_OUT) Y2.3(OSC2)  [project net XTAL-OUT_30]
NetC543_2: C543.2 C544.2 C545.2 P2.2
NetC546_2: C546.2 C547.2 C548.2 P2.5
NetC549_2: C549.2 C550.2 C551.2 P2.8
NetC552_2: C552.2 C553.2 C554.2 P2.11
NetD12_2: D12.2(K) D13.1(A) R163.2
NetD25_1: D25.1(A) R161.2
NetR63_1: port EN-ETH, sheet ETH-LDO/EN-ETH
NetR157_2: R157.2 U36.32(HSDAC_P)
NetR158_2: R158.2 U36.31(HSDAC_N)
NetR159_2: R159.2 U36.30(RSET)
NetR162_2: R162.2 U36.46(RX_CLK)
NetSL6_2: SL6.2 U36.39(AVDD18_OUT)

Not connected (* = marked no-connect by the designer): U36 1(SIN_P)* 2(SIN_N)* 4(SOUT_P)* 5(SOUT_N)* 9(CLK125)* 29(TSTPT)*; Y2 2(NC) 4(NC)

### Buses and harness runs
harness RGMII = port RGMII

### Layout directives
net class z50l12; net class eth: NetR162_2, RGMII.CONFIG, RGMII.MDC, RGMII.MDIO, RGMII.RESETN, RGMII.RXCLK, RGMII.RXCTRL, RGMII.RXD0, RGMII.RXD1, RGMII.RXD2, RGMII.RXD3, RGMII.TXCLK, RGMII.TXCTRL, RGMII.TXD0, RGMII.TXD1, RGMII.TXD2, RGMII.TXD3

### Notes on the sheet
- Title
- Engineer
- Revision
- Drawn By
- Checked By
- Date
- Sheet
- of

### Library data of the parts
C521 = CAP 0402: Ceramic Capacitor 220nF ±10% 25V X7R 0402; Manufacturer: TDK; Voltage: 25V; Manufacturer P/N: C1005X7R1E224K050BE; Package: 0402; Tolerance: ±10%
C522 C523 C525 C534-C538 C541 C542 C544 C547 C550 C553 C612-C614 = CAP 0402: Ceramic Capacitor 10nF ±10% 50V X7R 0402; Manufacturer: Murata; Tr: -55:125; Voltage: 50V; Manufacturer P/N: GRM155R71H103KA88; Package: 0402; Tolerance: ±10%
C529 C543 C546 C549 C552 C618 C619 = CAP 0402: Ceramic Capacitor 100nF ±10% 16V X7R 0402; Manufacturer: Murata; Tr: -55:125; Voltage: 16V; Manufacturer P/N: GRM155R71C104KA88J; Package: 0402; Tolerance: ±10%
C530 C620 = CAP 0402: Ceramic Capacitor 1uF ±10% 10V X5R 0402; Manufacturer: Murata; Tr: -55:125; Voltage: 10V; Manufacturer P/N: GRM155R61A105KE15; Package: 0402; Tolerance: ±10%
C532 C533 C539 C540 = CAP 0805: Ceramic Capacitor 2.2uF ±10% 10V X7R 0603; Manufacturer: Murata; Tr: -55:125; Voltage: 10V; Manufacturer P/N: GRM188R71A225KE15D; Package: 0603; Do Not Place: *; Tolerance: ±10%
C545 C548 C551 C554 = CAP 0402: Ceramic Capacitor 1nF ±5% 50V NP0 0402; Manufacturer: TDK; Tr: -55:150; Voltage: 50V; Manufacturer P/N: CGA2B2NP01H102J050BA; Package: 0402; Tolerance: ±5%
C555 C556 = CAP 0402: Ceramic Capacitor 6pF ±0.25pF 50V NP0 RF 0402; Manufacturer: Murata; Tr: -55:125; Voltage: 50V; Manufacturer P/N: GJM1555C1H6R0CB01D; Package: 0402; Tolerance: ±0.25pF
D12 = LED0603Y: LED, SMT 0603, Color Amber, 10mA, 2.05V; Manufacturer: Panasonic; Manufacturer P/N: LNJ412K84RA; Package: 0603 Polarized
D13 = LED0603GR: LED, SMT 0603, Color Green, 10mA, 2.05V; Manufacturer: Panasonic; Manufacturer P/N: LNJ326W83RA; Package: 0603 Polarized
D17-D24 = ESD8472: ESD Protection Diode; Manufacturer: On Semiconductor; Manufacturer P/N: ESD8472MUT5G
D25 = LED0603GR: LED, SMT 0603, Color White, 10mA, 2.05V; Manufacturer: Panasonic; Manufacturer P/N: LNJ037X8ARA; Package: 0603 Polarized
P2 = S12B-ZR: 1.5mm pitch right angle 12-position; Manufacturer: JST; Manufacturer P/N: S12B-ZR
R157 R158 = RES 0402: Thin Film Resistor 49.9 ±0.1% 0402; Manufacturer: Panasonic; Tr: -55:155; Package: 0402; Manufacturer P/N: ERA-2AEB49R9X; Tolerance: ±0.1%
R159 = RES 0402: Thick Film Resistor 4.99k ±1% 0402; Manufacturer: Panasonic; Tr: -55:155; Package: 0402; Manufacturer P/N: ERJ-2RKF4991X
R161 R163 = RES 0402: Thin Film Resistor 100 ±0.1% 0402; Manufacturer: Panasonic; Tr: -55:155; Package: 0402; Manufacturer P/N: ERA-2AEB101X; Tolerance: ±0.1%
R162 = RES 0402: Thick Film Resistor 22 ±1% 0402; Manufacturer: Yageo; Tr: -55:155; Package: 0402; Manufacturer P/N: RC0402FR-0722RL; Do Not Place: *; Tolerance: ±1%
R165 = RES 0402: Thick Film Resistor 10k ±1% 0.1W 50V 0402; Manufacturer: Panasonic; Tr: -55:155; Package: 0402; Manufacturer P/N: ERJ-2RKF1002X; Tolerance: ±1%
SL6 = RES: Solder Link, Bridged
U36 = 88E1512: Alaska Intergrated 1000/100/10 Ethernet PHY; Manufacturer: Marvell; Manufacturer P/N: 88E1512; Package: QFN-56
Y2 = XRCGB25M000F3N00R0: CRYSTAL, 25.000MHz, 30ppm, 6pF; Manufacturer: Murata; Manufacturer P/N: XRCGB25M000F3N00R0

## Sheet eth-ldo.SchDoc: Ethernet - LDOs
size Letter; CheckedBy: J. Brinton; CompanyName: Signal Laboratories, Inc.; DrawnBy: J. Brinton; Engineer: J. Brinton; Address1: 3479 Edison Way; Address2: Menlo Park CA 94025; Address3: +1 (877) 778-8435; Address4: siglabs.com; Revision: 3; SheetNumber: 31; SheetTotal: 49
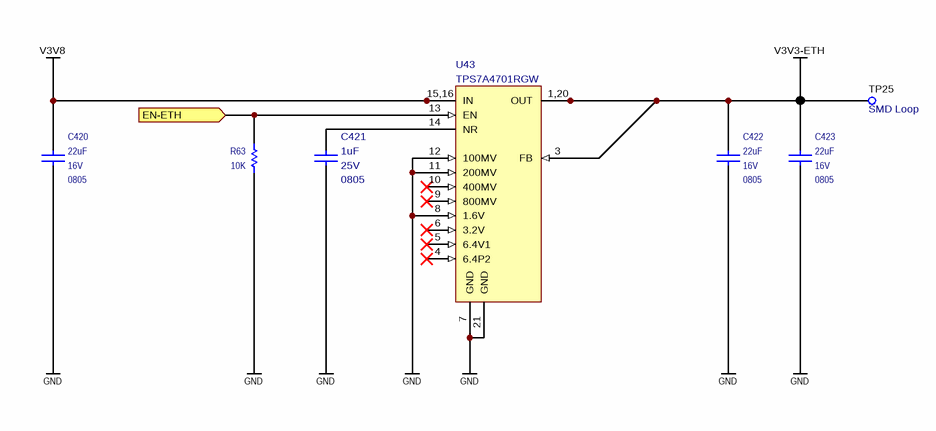
[diagram p3: eth-ldo.SchDoc]

### Parts
C420  value 22uF  Voltage: 16V  Package: 0805  [CAPC200X125X145L45N]  (hidden comment: CL21A226KOQNNNE)
C421  value 1uF  Package: 0805  Voltage: 25V  [CAPC200X125X145L45N]  (hidden comment: TMK212B7105KG)
C422  value 22uF  Voltage: 16V  Package: 0805  [CAPC200X125X145L45N]  (hidden comment: CL21A226KOQNNNE)
C423  value 22uF  Voltage: 16V  Package: 0805  [CAPC200X125X145L45N]  (hidden comment: CL21A226KOQNNNE)
R63  value 10K  [RESC1005X40N]  (hidden comment: ERJ-2RKF1002X)
TP25  Notes: SMD Loop  [5015]  (hidden comment: 5015)
U43  TPS7A4701RGW  [QFN65P500X500X100-21N]

### Ports
EN-ETH (in)

### Nets
GND: C420.1 C421.2 C422.1 C423.1 R63.2 U43.7(GND) U43.8(1.6V) U43.11(200MV) U43.12(100MV) U43.21(GND)
V3V3-ETH: C422.2 C423.2 TP25.1 U43.1(OUT) U43.3(FB) U43.20(OUT)
V3V8: C420.2 U43.15(IN) U43.16(IN)
NetC421_1: C421.1 U43.14(NR)
NetR63_1: R63.1 U43.13(EN) ; port EN-ETH

Not connected (* = marked no-connect by the designer): U43 4(6.4P2)* 5(6.4V1)* 6(3.2V)* 9(800MV)* 10(400MV)*

### Notes on the sheet
- Title
- Engineer
- Revision
- Drawn By
- Checked By
- Date
- Sheet
- of
- (in symbol TPS7A4701RGW_1) 15,16; 1,20

### Library data of the parts
C420 C422 C423 = CAP 0603: Ceramic Capacitor 22uF ±10% 16V X5R 0805; Manufacturer: Samsung; Tr: -55:85; Manufacturer P/N: CL21A226KOQNNNE; Tolerance: ±10%
C421 = TMK212B7105KG: Ceramic Capacitor 1uF ±10% 25V X7R 0805; Manufacturer: Taiyo Yuden; Manufacturer P/N: TMK212B7105KG; Tolerance: ±10%; Tr: *
R63 = RES 0402: as R165 on sheet eth; Package: 0402; Manufacturer P/N: ERJ-2RKF1002X; Tolerance: ±1%
TP25 = TEST_POINT_SMD_50: Test Point SMD; Manufacturer: Keystone; Manufacturer P/N: 5015
U43 = TPS7A4701RGW_1: Low-Dropout Linear Regulator 20-VQFN; Manufacturer: Texas Instruments; Manufacturer P/N: TPS7A4701RGW; Package: VQFN-20

## Sheet dsa.SchDoc: DSA
size Letter; CheckedBy: J. Brinton; CompanyName: Signal Laboratories, Inc.; DrawnBy: J. Brinton; Engineer: J. Brinton; Address1: 3479 Edison Way; Address2: Menlo Park CA 94025; Address3: +1 (877) 778-8435; Address4: siglabs.com; Revision: 3; SheetNumber: 15; SheetTotal: 49
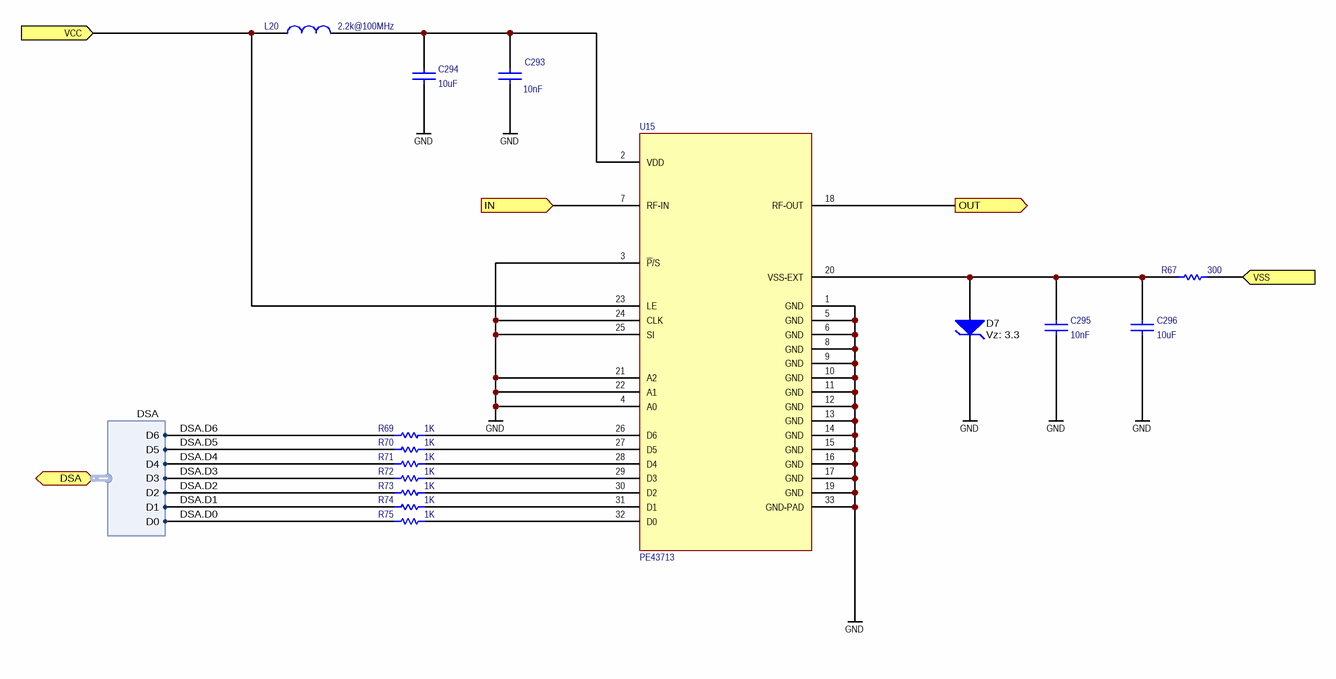
[diagram p4: dsa.SchDoc]

### Parts
C293  value 10nF  [CAPC100X50X55L25N]  (hidden comment: GRM155R71H103KA88)
C294  value 10uF  [CAPC160X80X90L20N]  (hidden comment: ZRB18AR61E106ME01L)
C295  value 10nF  [CAPC100X50X55L25N]  (hidden comment: GRM155R71H103KA88)
C296  value 10uF  [CAPC160X80X90L20N]  (hidden comment: ZRB18AR61E106ME01L)
D7  Vz: 3.3  [SOD523]  (hidden comment: BZT585B3V3T-7)
L20  value 2.2k@100MHz  [INDC1005X55N]  (hidden comment: MMZ1005A222ET000)
R67  value 300  [RESC2012X70N]  (hidden comment: RG2012P-301-B-T5)
R69  value 1K  [RESC1005X40N]  (hidden comment: RC0402FR-071KL)
R70  value 1K  [RESC1005X40N]  (hidden comment: RC0402FR-071KL)
R71  value 1K  [RESC1005X40N]  (hidden comment: RC0402FR-071KL)
R72  value 1K  [RESC1005X40N]  (hidden comment: RC0402FR-071KL)
R73  value 1K  [RESC1005X40N]  (hidden comment: RC0402FR-071KL)
R74  value 1K  [RESC1005X40N]  (hidden comment: RC0402FR-071KL)
R75  value 1K  [RESC1005X40N]  (hidden comment: RC0402FR-071KL)
U15  PE43713  [QFN-PE-32]

### Ports
DSA (harness DSA), IN (in), OUT (out), VCC (in), VSS (in)

### Harnesses
DSA: D6, D5, D4, D3, D2, D1, D0

### Nets
GND: C293.1 C294.1 C295.1 C296.1 D7.1(K) U15.1(GND) U15.3(~{P}/S) U15.4(A0) U15.5(GND) U15.6(GND) U15.8(GND) U15.9(GND) U15.10(GND) U15.11(GND) U15.12(GND) U15.13(GND) U15.14(GND) U15.15(GND) U15.16(GND) U15.17(GND) U15.19(GND) U15.21(A2) U15.22(A1) U15.24(CLK) U15.25(SI) U15.33(GND-PAD)
DSA.D0: R75.2 ; port DSA.D0
DSA.D1: R74.2 ; port DSA.D1
DSA.D2: R73.2 ; port DSA.D2
DSA.D3: R72.2 ; port DSA.D3
DSA.D4: R71.2 ; port DSA.D4
DSA.D5: R70.2 ; port DSA.D5
DSA.D6: R69.2 ; port DSA.D6
NetC293_2: C293.2 C294.2 L20.2 U15.2(VDD)
NetC295_2: C295.2 C296.2 D7.2(A) R67.1 U15.20(VSS-EXT)
NetL20_1: L20.1 U15.23(LE) ; port VCC
NetR67_2: R67.2 ; port VSS
NetR69_1: R69.1 U15.26(D6)
NetR70_1: R70.1 U15.27(D5)
NetR71_1: R71.1 U15.28(D4)
NetR72_1: R72.1 U15.29(D3)
NetR73_1: R73.1 U15.30(D2)
NetR74_1: R74.1 U15.31(D1)
NetR75_1: R75.1 U15.32(D0)
NetU15_7: U15.7(RF-IN) ; port IN
NetU15_18: U15.18(RF-OUT) ; port OUT

### Library data of the parts
C293 C295 = CAP 0402: as C522 on sheet eth
C294 C296 = CAP 0603: Ceramic Capacitor 10uF ±20% 25V X5R 0603; Manufacturer: Murata; Tr: -55:85
D7 = ZENER: 3.3V Zener Diode SOD-523; Manufacturer: Diodes Inc
L20 = INDUCTANCE1: Ferrite Bead 2.2k@100MHz 150mA 0402; Manufacturer: TDK; Tr: -55:125
R67 = RES: Thin Film Resistor 300 +/-0.1% SMD 0805; Manufacturer: Susumu; Tolerance: ±0.1%; Tr: -55:155
R69-R75 = RES 0402: Thick Film Resistor 1k ±1% 0402; Manufacturer: Yageo; Tr: -55:155
U15 = PE43713: Digital Step Attenuaator, 9kHz-6GHz; Manufacturer: Peregrine Semiconductor

## Sheet ifamp-tx.SchDoc: TX IF Amplifier
size Letter; CheckedBy: J. Brinton; CompanyName: Signal Laboratories, Inc.; DrawnBy: J. Brinton; Engineer: J. Brinton; Address1: 3479 Edison Way; Address2: Menlo Park CA 94025; Address3: +1 (877) 778-8435; Address4: siglabs.com; Revision: 3; SheetNumber: 5; SheetTotal: 49
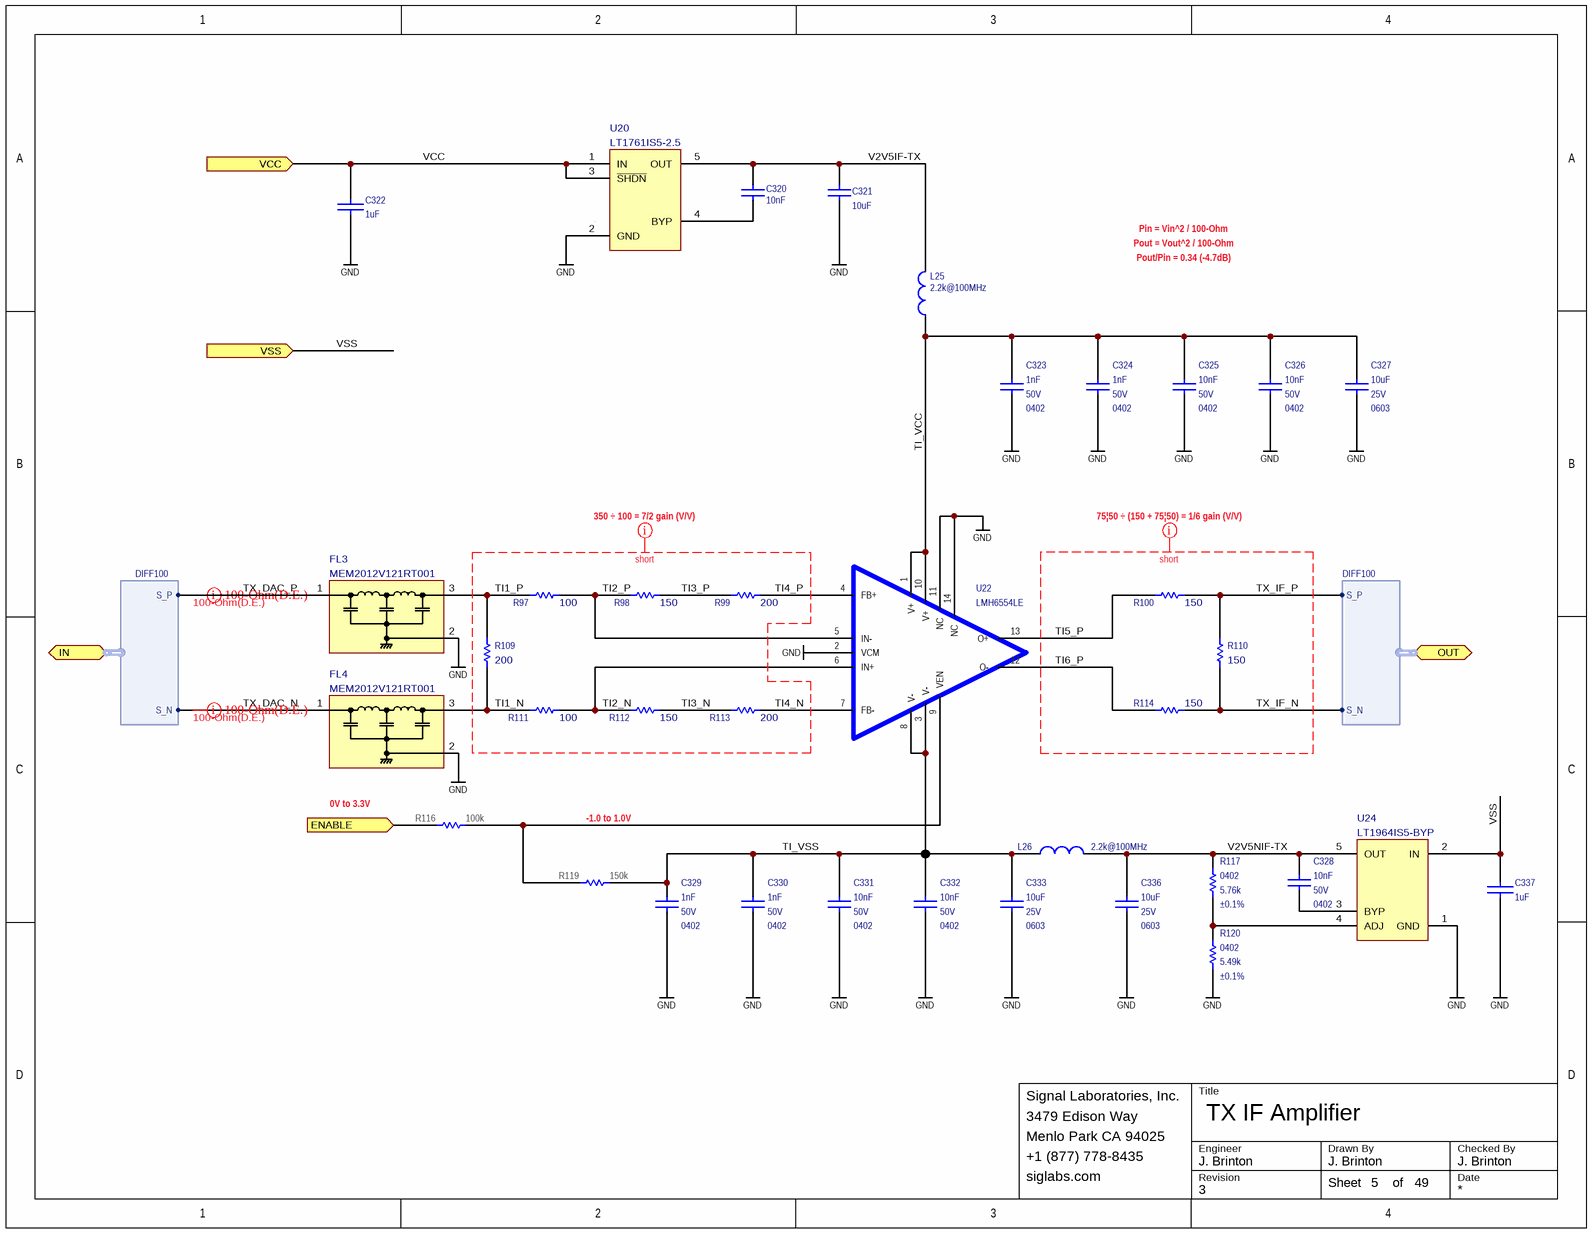
[diagram p5: ifamp-tx.SchDoc]

### Parts
C320  value 10nF  [CAPC100X50X55L25N]  (hidden comment: GRM155R71H103KA88)
C321  value 10uF  [CAPC160X80X90L20N]  (hidden comment: ZRB18AR61E106ME01L)
C322  value 1uF  [CAPC100X50X55L25N]  (hidden comment: GRM155R61A105KE15)
C323  value 1nF  Voltage: 50V  Package: 0402  [CAPC100X50X55L25N]  (hidden comment: CGA2B2NP01H102J050BA)
C324  value 1nF  Voltage: 50V  Package: 0402  [CAPC100X50X55L25N]  (hidden comment: CGA2B2NP01H102J050BA)
C325  value 10nF  Voltage: 50V  Package: 0402  [CAPC100X50X55L25N]  (hidden comment: GRM155R71H103KA88)
C326  value 10nF  Voltage: 50V  Package: 0402  [CAPC100X50X55L25N]  (hidden comment: GRM155R71H103KA88)
C327  value 10uF  Voltage: 25V  Package: 0603  [CAPC160X80X90L20N]  (hidden comment: ZRB18AR61E106ME01L)
C328  value 10nF  Voltage: 50V  Package: 0402  [CAPC100X50X55L25N]  (hidden comment: GRM155R71H103KA88)
C329  value 1nF  Voltage: 50V  Package: 0402  [CAPC100X50X55L25N]  (hidden comment: CGA2B2NP01H102J050BA)
C330  value 1nF  Voltage: 50V  Package: 0402  [CAPC100X50X55L25N]  (hidden comment: CGA2B2NP01H102J050BA)
C331  value 10nF  Voltage: 50V  Package: 0402  [CAPC100X50X55L25N]  (hidden comment: GRM155R71H103KA88)
C332  value 10nF  Voltage: 50V  Package: 0402  [CAPC100X50X55L25N]  (hidden comment: GRM155R71H103KA88)
C333  value 10uF  Voltage: 25V  Package: 0603  [CAPC160X80X90L20N]  (hidden comment: ZRB18AR61E106ME01L)
C336  value 10uF  Voltage: 25V  Package: 0603  [CAPC160X80X90L20N]  (hidden comment: ZRB18AR61E106ME01L)
C337  value 1uF  [CAPC100X50X55L25N]  (hidden comment: GRM155R61A105KE15)
FL3  MEM2012V121RT001  [MEM2012V]
FL4  MEM2012V121RT001  [MEM2012V]
L25  value 2.2k@100MHz  [INDC1005X55N]  (hidden comment: MMZ1005A222ET000)
L26  value 2.2k@100MHz  [INDC1005X55N]  (hidden comment: MMZ1005A222ET000)
R97  value 100  [RESC1608X55N]  (hidden comment: MCT0603MD1000DP500)
R98  value 150  [RESC1608X55N]  (hidden comment: MCT0603MD1500DP500)
R99  value 200  [RESC1608X55N]  (hidden comment: MCT06030C2000FP500)
R100  value 150  [RESC1608X55N]  (hidden comment: MCT0603MD1500DP500)
R109  value 200  [RESC1608X55N]  (hidden comment: MCT06030C2000FP500)
R110  value 150  [RESC1608X55N]  (hidden comment: MCT0603MD1500DP500)
R111  value 100  [RESC1608X55N]  (hidden comment: MCT0603MD1000DP500)
R112  value 150  [RESC1608X55N]  (hidden comment: MCT0603MD1500DP500)
R113  value 200  [RESC1608X55N]  (hidden comment: MCT06030C2000FP500)
R114  value 150  [RESC1608X55N]  (hidden comment: MCT0603MD1500DP500)
R116  value 100k  [RESC1005X40N]  (hidden comment: ERJ-2RKF1003X)
R117  value 5.76k  Tolerance: ±0.1%  Package: 0402  [RESC1005X40N]  (hidden comment: RT0402BRE075K76L)
R119  value 150k  [RESC1005X40N]  (hidden comment: ERJ-2RKF1503X)
R120  value 5.49k  Tolerance: ±0.1%  Package: 0402  [RESC1005X40N]  (hidden comment: ERA-2AEB5491X)
U20  LT1761IS5-2.5  [TSOT-5]
U22  LMH6554LE  [NHJ0014A]
U24  LT1964IS5-BYP  [SOT23-5]

### Ports
ENABLE (in), IN (harness DIFF100), OUT (harness DIFF100), VCC (in), VSS (in)

### Harnesses
DIFF100: S_P, S_N

### Nets
GND: C321.1 C322.1 C323.1 C324.1 C325.1 C326.1 C327.1 C329.1 C330.1 C331.1 C332.1 C333.1 C336.1 C337.1 FL3.2(GND) FL4.2(GND) R120.1 U20.2(GND) U22.2(VCM) U22.11(NC) U22.14(NC) U24.1(GND)
TI1_N: FL4.3(OUT/IN) R109.1 R111.1  [project net TI1_N_5]
TI1_P: FL3.3(OUT/IN) R97.1 R109.2  [project net TI1_P_5]
TI2_N: R111.2 R112.1 U22.6(IN+)  [project net TI2_N_5]
TI2_P: R97.2 R98.1 U22.5(IN-)  [project net TI2_P_5]
TI3_N: R112.2 R113.1  [project net TI3_N_5]
TI3_P: R98.2 R99.1  [project net TI3_P_5]
TI4_N: R113.2 U22.7(FB-)  [project net TI4_N_5]
TI4_P: R99.2 U22.4(FB+)  [project net TI4_P_5]
TI5_P: R100.1 U22.13(O+)  [project net TI5_P_5]
TI6_P: R114.1 U22.12(O-)  [project net TI6_P_5]
TI_VCC: C323.2 C324.2 C325.2 C326.2 C327.2 L25.1 U22.1(V+) U22.10(V+)  [project net TI_VCC_5]
TI_VSS: C329.2 C330.2 C331.2 C332.2 C333.2 L26.1 R119.1 U22.3(V-) U22.8(V-)  [project net TI_VSS_5]
TX_DAC_N: FL4.1(IN/OUT) ; port IN.S_N
TX_DAC_P: FL3.1(IN/OUT) ; port IN.S_P
TX_IF_N: R110.1 R114.2 ; port OUT.S_N
TX_IF_P: R100.2 R110.2 ; port OUT.S_P
V2V5IF-TX: C320.2 C321.2 L25.2 U20.5(OUT)  [project net V2V5IF-TX_5]
V2V5NIF-TX: C328.2 C336.2 L26.2 R117.2 U24.5(OUT)  [project net V2V5NIF-TX_5]
VCC: C322.2 U20.1(IN) U20.3(~{SHDN}) ; port VCC
VSS: C337.2 U24.2(IN) ; port VSS
NetC320_1: C320.1 U20.4(BYP)
NetC328_1: C328.1 U24.3(BYP)
NetR116_1: R116.1 R119.2 U22.9(VEN)
NetR116_2: R116.2 ; port ENABLE
NetR117_1: R117.1 R120.2 U24.4(ADJ)

### Layout directives
differential pair; net class z100diff12; Name: 100-Ohm(D.E.); net class rf: TX_DAC_N, TX_DAC_P
net class short: TI1_N, TI1_P, TI2_N, TI2_P, TI3_N, TI3_P, TI4_N, TI4_P, TI5_P, TI6_P, TX_IF_N, TX_IF_P

### Notes on the sheet
- Pin = Vin^2 / 100-Ohm
- Pout = Vout^2 / 100-Ohm
- Pout/Pin = 0.34 (-4.7dB)
- 350 ÷ 100 = 7/2 gain (V/V)
- 75|50 ÷ (150 + 75|50) = 1/6 gain (V/V)
- 0V to 3.3V
- -1.0 to 1.0V
- Title
- Engineer
- Revision
- Drawn By
- Checked By
- Date
- Sheet
- of

### Library data of the parts
C320 C325 C326 C328 C331 C332 = CAP 0402: as C522 on sheet eth; Manufacturer P/N: GRM155R71H103KA88; Tolerance: ±10%
  C320: Voltage: 50V; Package: 0402
C321 C327 C333 C336 = CAP 0603: as C294 on sheet dsa; Manufacturer P/N: ZRB18AR61E106ME01L; Tolerance: ±20%
  C321: Voltage: 25V; Package: 0603
C322 C337 = CAP: Ceramic Capacitor 1uF ±10% 10V X5R 0402; Manufacturer: Murata; Tr: -55:125; Manufacturer P/N: GRM155R61A105KE15; Package: 0402; Tolerance: ±10%; Voltage: 10V
C323 C324 C329 C330 = CAP 0402: as C545 on sheet eth; Manufacturer P/N: CGA2B2NP01H102J050BA; Tolerance: ±5%
FL3 FL4 = MEM2012V121RT001: MEM2012 Series 120 MHz 10V 100mA SMT Signal Line 3-Terminal Filter; Manufacturer: TDK; Package: MEM2012V; Manufacturer P/N: MEM2012V121RT001
L25 L26 = INDUCTANCE1: as L20 on sheet dsa; Manufacturer P/N: MMZ1005A222ET000; Package: 0402
R97 R111 = RES 0603: Thin Film Resistor 100 Ohm ±0.5% 0603; Manufacturer: Vishay; Tr: -55:175; Package: 0603; Manufacturer P/N: MCT0603MD1000DP500; Do Not Place: *; Tolerance: ±0.5%
R98 R100 R110 R112 R114 = RES 0603: Thin Film Resistor 150 Ohm ±0.5% 0603; Manufacturer: Vishay; Tr: -55:155; Package: 0603; Manufacturer P/N: MCT0603MD1500DP500; Do Not Place: *; Tolerance: ±0.5%
R99 R109 R113 = RES 0603: Thin Film Resistor 200 Ohm ±1% 0603; Manufacturer: Vishay; Tr: -55:155; Package: 0603; Manufacturer P/N: MCT06030C2000FP500; Do Not Place: *; Tolerance: ±1%
R116 = RES: Thick Film Resistor 100k ±1% 0.1W 50V 0402; Manufacturer: Panasonic; Tcr: ±100; Tr: -55:155; Voltage: 50; Power: 0.1; Manufacturer P/N: ERJ-2RKF1003X; Tolerance: ±1%; Alternatives: *; Footprint: *; Package: 0402
R117 = RES: Thin Film Resistor 5.76k +/-0.1% SMD 0402; Manufacturer: Yageo; Tr: -55:155; Tcr: *; Manufacturer P/N: RT0402BRE075K76L; Alternatives: *; Voltage: *; Power: *
R119 = RES: Thick Film Resistor 150k ±1% 0.1W 50V 0402; Manufacturer: Panasonic; Tcr: ±100; Tr: -55:155; Voltage: 50; Power: 0.1; Manufacturer P/N: ERJ-2RKF1503X; Tolerance: ±1%; Alternatives: *; Footprint: *; Package: 0402
R120 = RES: Thin Film Resistor 5.49k +/-0.1% SMD 0402; Manufacturer: Panasonic; Tr: -55:155; Tcr: *; Manufacturer P/N: ERA-2AEB5491X; Alternatives: *; Voltage: *; Power: *
U20 = LT1761IS5-5: 100mA Low Noise LDO 5V; Manufacturer: Linear Technology; Manufacturer P/N: LT1761IS5-5
U22 = LMH6554LE: 2.8 GHz Ultra Linear Fully Differential Amplifier; Manufacturer: Texas Instruments; Manufacturer P/N: LMH6554LE
U24 = LT1964IS5-BYP: 200mA Low Noise negative-LDO; Manufacturer: Linear Technology; Manufacturer P/N: LT1964IS5-BYP

## Sheet amp-33dbm.SchDoc: RF Amp (33dBm)
size Letter; CheckedBy: J. Brinton; CompanyName: Signal Laboratories, Inc.; DrawnBy: J. Brinton; Engineer: J. Brinton; Address1: 3479 Edison Way; Address2: Menlo Park CA 94025; Address3: +1 (877) 778-8435; Address4: siglabs.com; Revision: 3; SheetNumber: 8; SheetTotal: 49
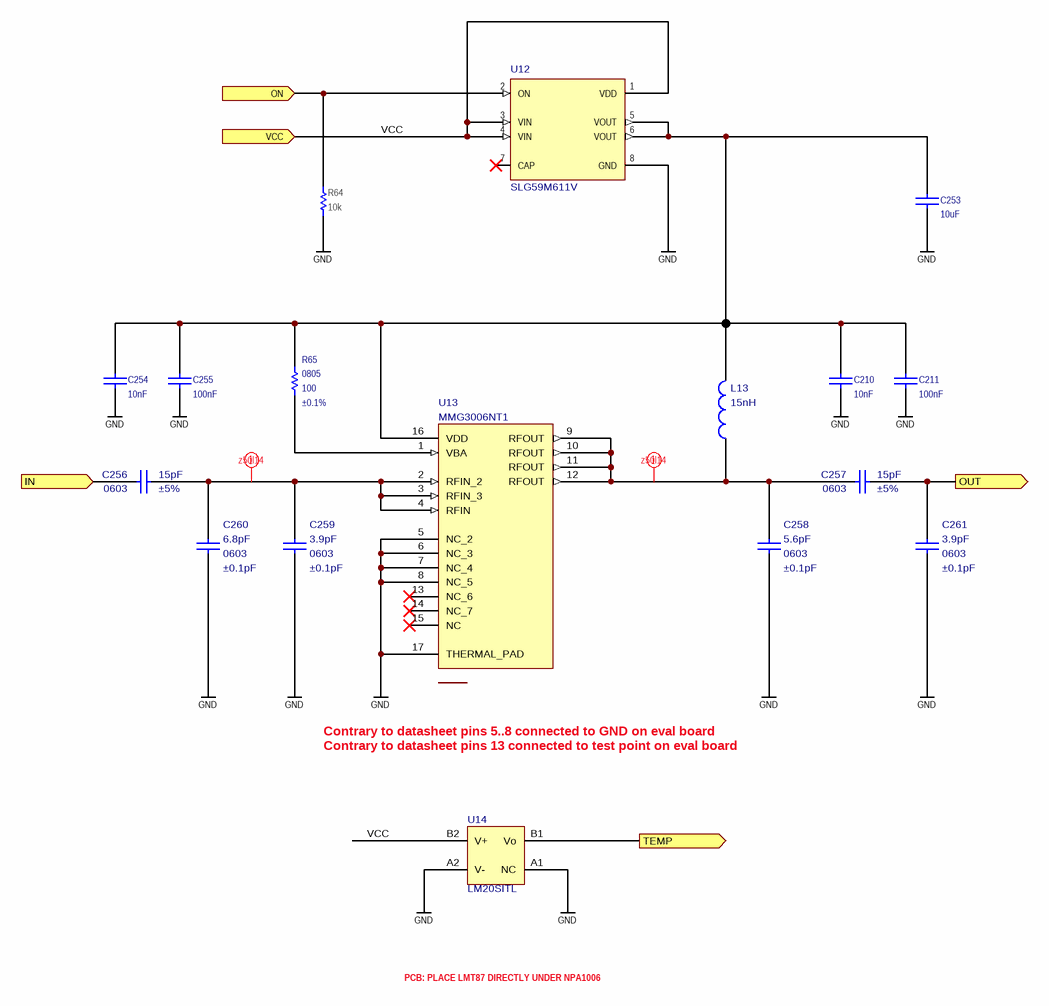
[diagram p6: amp-33dbm.SchDoc]

### Parts
C210  value 10nF  [CAPC100X50X55L25N]  (hidden comment: GRM155R71H103KA88)
C211  value 100nF  [CAPC100X50X55L25N]  (hidden comment: GRM155R71C104KA88J)
C253  value 10uF  [CAPC160X80X90L20N]  (hidden comment: ZRB18AR61E106ME01L)
C254  value 10nF  [CAPC100X50X55L25N]  (hidden comment: GRM155R71H103KA88)
C255  value 100nF  [CAPC100X50X55L25N]  (hidden comment: GRM155R71C104KA88J)
C256  value 15pF  Tolerance: ±5%  Package: 0603  [CAPC160X80X90L20N]  (hidden comment: GQM1885C1H150JB01D)
C257  value 15pF  Tolerance: ±5%  Package: 0603  [CAPC160X80X90L20N]  (hidden comment: GQM1885C1H150JB01D)
C258  value 5.6pF  Tolerance: ±0.1pF  Package: 0603  [CAPC160X80X90L20N]  (hidden comment: 06032U5R6BAT2A)
C259  value 3.9pF  Tolerance: ±0.1pF  Package: 0603  [CAPC160X80X90L20N]  (hidden comment: 06032U3R9BAT2A)
C260  value 6.8pF  Tolerance: ±0.1pF  Package: 0603  [CAPC160X80X90L20N]  (hidden comment: 06032U6R8BAT2A)
C261  value 3.9pF  Tolerance: ±0.1pF  Package: 0603  [CAPC160X80X90L20N]  (hidden comment: 06032U3R9BAT2A)
L13  value 15nH  [1008CS]  (hidden comment: 1008CS-150XJB)
R64  value 10k  [RESC1005X40N]  (hidden comment: ERJ-2RKF1002X)
R65  value 100  Tolerance: ±0.1%  Package: 0805  [RESC2012X70N]  (hidden comment: RG2012P-101-B-T5)
U12  SLG59M611V  [DFN200X150X80-8N]
U13  MMG3006NT1  [QFN65P400X400X90-17N]
U14  LM20SITL  [YZR-4]

### Ports
IN (in), ON (in), OUT (out), TEMP (out), VCC (in)

### Nets
GND: C210.1 C211.1 C253.1 C254.1 C255.1 C258.1 C259.1 C260.1 C261.1 R64.1 U12.8(GND) U13.5(NC_2) U13.6(NC_3) U13.7(NC_4) U13.8(NC_5) U13.17(THERMAL_PAD) U14.A1(NC) U14.A2(V-)
VCC: U12.1(VDD) U12.3(VIN) U12.4(VIN) U14.B2(V+) ; port VCC
NetC210_2: C210.2 C211.2 C253.2 C254.2 C255.2 L13.2 R65.2 U12.5(VOUT) U12.6(VOUT) U13.16(VDD)
NetC256_1: C256.1 ; port IN
NetC256_2: C256.2 C259.2 C260.2 U13.2(RFIN_2) U13.3(RFIN_3) U13.4(RFIN)
NetC257_1: C257.1 C258.2 L13.1 U13.9(RFOUT) U13.10(RFOUT) U13.11(RFOUT) U13.12(RFOUT)
NetC257_2: C257.2 C261.2 ; port OUT
NetR64_2: R64.2 U12.2(ON) ; port ON
NetR65_1: R65.1 U13.1(VBA)
NetU14_B1: U14.B1(Vo) ; port TEMP

Not connected (* = marked no-connect by the designer): U12 7(CAP)*; U13 13(NC_6)* 14(NC_7)* 15(NC)*

### Layout directives
net class z50l14: NetC256_2, NetC257_1

### Notes on the sheet
- Contrary to datasheet pins 5..8 connected to GND on eval board
- Contrary to datasheet pins 13 connected to test point on eval board
- PCB: PLACE LMT87 DIRECTLY UNDER NPA1006
- Title
- Engineer
- Revision
- Drawn By
- Checked By
- Date
- Sheet
- of

### Library data of the parts
C210 C254 = CAP 0402: as C522 on sheet eth; Voltage: 50V; Manufacturer P/N: GRM155R71H103KA88; Package: 0402; Tolerance: ±10%
C211 C255 = CAP 0402: as C529 on sheet eth; Voltage: 16V; Manufacturer P/N: GRM155R71C104KA88J; Package: 0402; Tolerance: ±10%
C253 = CAP 0603: as C294 on sheet dsa; Manufacturer P/N: ZRB18AR61E106ME01L; Voltage: 25V; Package: 0603; Tolerance: ±20%
C256 C257 = CAP: Ceramic Capacitor 15pF ±5% NP0 0603; Manufacturer: Murata; Voltage: 50V; Tr: -55"125; Manufacturer P/N: GQM1885C1H150JB01D
C258 = CAP: Ceramic Capacitor 5.6pF ±0.1pF NP0 0603; Manufacturer: AVX; Voltage: 200V; Tr: -55"125; Manufacturer P/N: 06032U5R6BAT2A
C259 C261 = CAP: Ceramic Capacitor 3.9pF ±0.1pF NP0 0603; Manufacturer: AVX; Voltage: 200V; Tr: -55"125; Manufacturer P/N: 06032U3R9BAT2A
C260 = CAP: Ceramic Capacitor 6.8pF ±0.1pF NP0 0603; Manufacturer: AVX; Voltage: 200V; Tr: -55"125; Manufacturer P/N: 06032U6R8BAT2A
L13 = INDUCTOR: Inductor 15nH 1A; Manufacturer: Coilcraft; Manufacturer P/N: 1008CS-150XJB
R64 = RES: Thick Film Resistor 10k ±1% 0.1W 50V 0402; Manufacturer: Panasonic; Tcr: ±100; Tr: -55:155; Voltage: 50; Power: 0.1; Manufacturer P/N: ERJ-2RKF1002X; Tolerance: ±1%; Alternatives: *; Footprint: *; Package: 0402
R65 = RES: Thin Film Resistor 100 +/-0.1% SMD 0805; Manufacturer: Susumu; Tr: -55:155; Tcr: *; Manufacturer P/N: RG2012P-101-B-T5; Alternatives: *; Voltage: *; Power: *
U12 = SLG59M611V: High-Side Load Switch; Manufacturer: Silego; Package: WFDFN-8 Silego; Manufacturer P/N: SLG59M611V
U13 = MMG3006NT1: RF Amp Chip Single GP 2.4GHz 6V 16-Pin QFN EP T/R; Manufacturer: NXP Semiconductors; Package: QFN-16 NXP Semiconductors; Value: *; Manufacturer P/N: MMG3006NT1
U14 = LM20SITL: Analog Temperature Sensor; Manufacturer: Texas Instruments; Manufacturer P/N: LM20SITL; Package: DSBGA-4